# EAGLE design minicar_r3 (EAGLE 7.7.0)
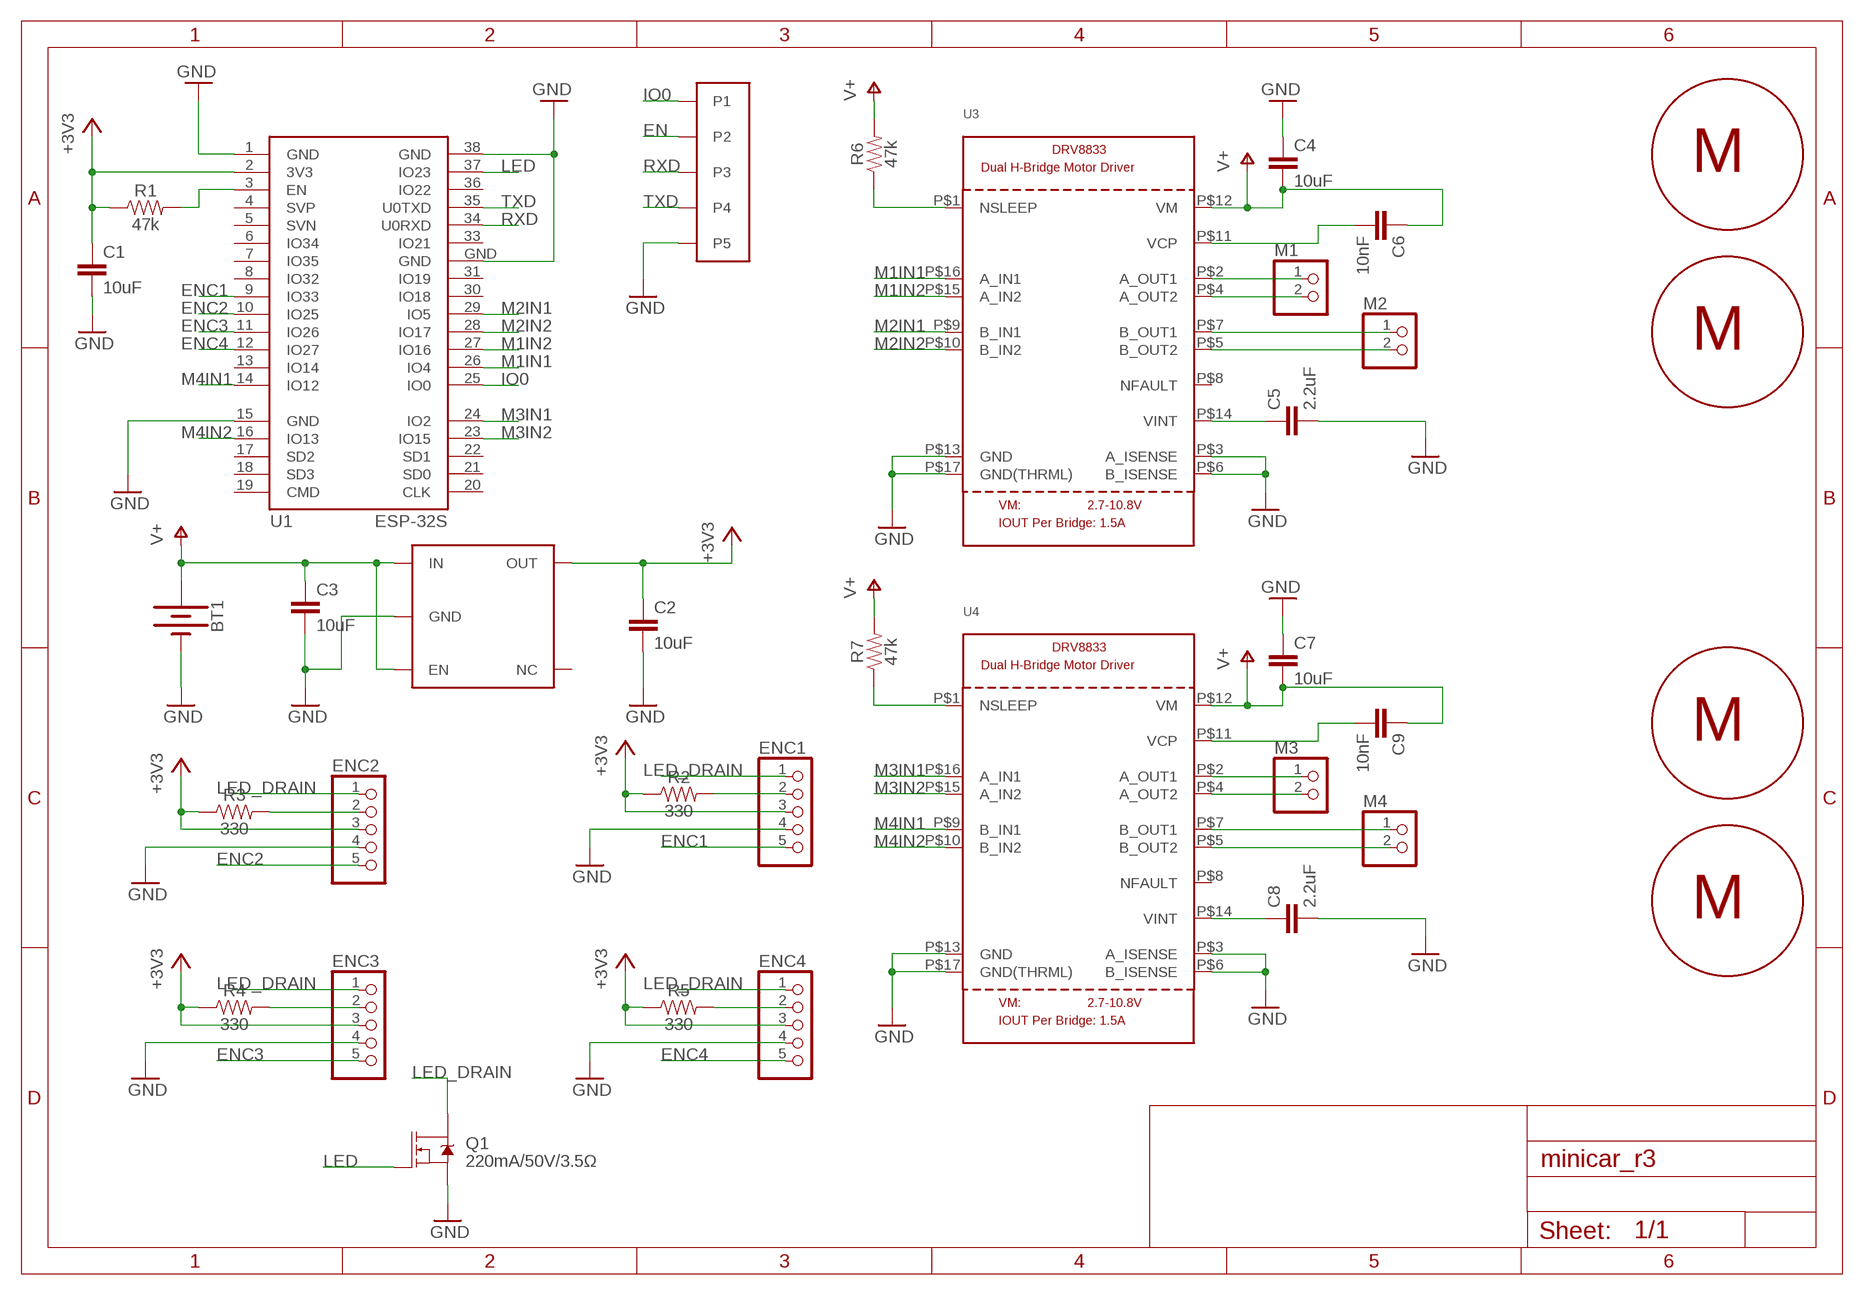
[diagram p0: schematic, sheet 1]

## Parts
BT1  BATTERY-AA  [BATTERY-AA]
C1  10uF  10UF-0805-10V-10%  [0805]
C2  10uF  10UF-0805-10V-10%  [0805]
C3  10uF  10UF-0805-10V-10%  [0805]
C4  10uF  10UF-0805-10V-10%  [0805]
C5  2.2uF  2.2UF-0603-10V-20%  [0603]
C6  10nF  10NF-0603-50V-10%  [0603]
C7  10uF  10UF-0805-10V-10%  [0805]
C8  2.2uF  2.2UF-0603-10V-20%  [0603]
C9  10nF  10NF-0603-50V-10%  [0603]
ENC1  PINHD-1X5  [1X05]
ENC2  PINHD-1X5  [1X05]
ENC3  PINHD-1X5  [1X05]
ENC4  PINHD-1X5  [1X05]
M1  PINHD-1X2  [1X02]
M2  PINHD-1X2  [1X02]
M3  PINHD-1X2  [1X02]
M4  PINHD-1X2  [1X02]
Q1  220mA/50V/3.5Ω  MOSFET-NCH-BSS138  [SOT23-3]
R1  47k  47KOHM-0603-1/10W-1%  [0603]
R2  330  330OHM-0603-1/10W-1%  [0603]
R3  330  330OHM-0603-1/10W-1%  [0603]
R4  330  330OHM-0603-1/10W-1%  [0603]
R5  330  330OHM-0603-1/10W-1%  [0603]
R6  47k  47KOHM-0603-1/10W-1%  [0603]
R7  47k  47KOHM-0603-1/10W-1%  [0603]
U1  ESP-32S  [ESP-32S]
U2  53047  [PICOBLADE_53047]
U3  DRV8833  [HTSSOP16]
U4  DRV8833  [HTSSOP16]
U5  TLV755  [SOT23-DBV]
U$2  MOTOR_10X27MM  [MOTOR]
U$3  MOTOR_10X27MM  [MOTOR]
U$4  MOTOR_10X27MM  [MOTOR]
U$5  MOTOR_10X27MM  [MOTOR]

## Nets
+3V3: C1.1 C2.1 ENC1.3 ENC2.3 ENC3.3 ENC4.3 R1.1 R2.1 R3.1 R4.1 R5.1 U1.2(3V3) U5.5(OUT)
EN: R1.2 U1.3(EN) U2.P$2(P2)
ENC1: ENC1.5 U1.9(IO33)
ENC2: ENC2.5 U1.10(IO25)
ENC3: ENC3.5 U1.11(IO26)
ENC4: ENC4.5 U1.12(IO27)
GND: BT1.GND@1(-) C1.2 C2.2 C3.2 C4.1 C5.2 C7.1 C8.2 ENC1.4 ENC2.4 ENC3.4 ENC4.4 Q1.2(S) U1.1(GND) U1.15(GND) U1.38(GND) U1.GND U2.P$5(P5) U3.P$3(A_ISENSE) U3.P$6(B_ISENSE) U3.P$13(GND) U3.P$17(GND(THRML)) U4.P$3(A_ISENSE) U4.P$6(B_ISENSE) U4.P$13(GND) U4.P$17(GND(THRML)) U5.2(GND)
IO0: U1.25(IO0) U2.P$1(P1)
LED: Q1.1(G) U1.37(IO23)
LED_DRAIN: ENC1.1 ENC2.1 ENC3.1 ENC4.1 Q1.3(D)
M1IN1: U1.26(IO4) U3.P$16(A_IN1)
M1IN2: U1.27(IO16) U3.P$15(A_IN2)
M2IN1: U1.29(IO5) U3.P$9(B_IN1)
M2IN2: U1.28(IO17) U3.P$10(B_IN2)
M3IN1: U1.24(IO2) U4.P$16(A_IN1)
M3IN2: U1.23(IO15) U4.P$15(A_IN2)
M4IN1: U1.14(IO12) U4.P$9(B_IN1)
M4IN2: U1.16(IO13) U4.P$10(B_IN2)
N$1: M1.1 U3.P$2(A_OUT1)
N$2: M1.2 U3.P$4(A_OUT2)
N$3: M2.1 U3.P$7(B_OUT1)
N$4: M2.2 U3.P$5(B_OUT2)
N$5: C5.1 U3.P$14(VINT)
N$6: C6.2 U3.P$11(VCP)
N$7: M3.1 U4.P$2(A_OUT1)
N$8: M3.2 U4.P$4(A_OUT2)
N$9: M4.1 U4.P$7(B_OUT1)
N$10: M4.2 U4.P$5(B_OUT2)
N$11: C8.1 U4.P$14(VINT)
N$12: C9.2 U4.P$11(VCP)
N$13: ENC1.2 R2.2
N$14: ENC4.2 R5.2
N$15: ENC3.2 R4.2
N$16: ENC2.2 R3.2
N$17: R6.1 U3.P$1(NSLEEP)
N$18: R7.1 U4.P$1(NSLEEP)
RXD: U1.34(U0RXD) U2.P$3(P3)
TXD: U1.35(U0TXD) U2.P$4(P4)
V+: BT1.PWR@1(+) C3.1 C4.2 C6.1 C7.2 C9.1 R6.2 R7.2 U3.P$12(VM) U4.P$12(VM) U5.1(IN) U5.3(EN)
Unconnected: U1.4(SVP) U1.5(SVN) U1.6(IO34) U1.7(IO35) U1.8(IO32) U1.13(IO14) U1.17(SD2) U1.18(SD3) U1.19(CMD) U1.20(CLK) U1.21(SD0) U1.22(SD1) U1.30(IO18) U1.31(IO19) U1.33(IO21) U1.36(IO22) U3.P$8(NFAULT) U4.P$8(NFAULT) U5.4(NC)

## Library data of the parts
BT1 = SparkFun-Batteries:BATTERY: Battery - Single Cell A variety of battery chemistries, sizes, and footprints. Device List: 20MM_PTH - Coin Cell Battery Holder - 20mm (PTH) <https://www.sparkfun.com/products/783> 12MM_SMD - Coin Cell Battery Holder - 12mm (SMD) <https://www.sparkfun.com/products/10592> 12MM_PTH - Coin Cell Battery Holder - 12mm (PTH) <https://www.sparkfun.com/products/7948> 20MM_SMD - 20mm Coin Cell Battery Holder (SMD) (2 legs) Used on the Big Time Watch Kit <https://www.sparkfun.com/products/11734> 20MM_SMD_4LEGS - Coin Cell Battery Holder - 20mm (SMD) <https://www.sparkfun.com/products/11892> 20MM_SMD_4LEGS_OVERPASTE - Coin Cell Battery Holder - 20mm (SMD) <https://www.sparkfun.com/products/11892> (Over-paste on the legs) 24.5MM_PTH - Coin Cell Battery Holder - 24.5mm (PTH) <https://www.sparkfun.com/products/8863> 9V - 9V Battery Holder - PC Mount Used on the SparkFun SparkPunk Sound Kit <https://www.sparkfun.com/products/11177> and SparkFun SparkPunk Sequencer Kit <https://www.sparkfun.com/products/12707> 18650 - Battery Holder - 18650 (PTH) <https://www.sparkfun.com/products/13113> AA - Battery Holder - 1xAA (PTH) <https://www.sparkfun.com/products/7949> AAA - Battery Holder - 1xAAA (PTH) <https://www.sparkfun.com/products/12718> AA_KIT - Battery Holder - 1xAA (PTH) <https://www.sparkfun.com/products/7949> Special kit package - pads only have exposed copper on one side of the board. AAA_KIT - Battery Holder - 1xAAA (PTH) <https://www.sparkfun.com/products/12718> Special kit package - pads only have exposed copper on one side of the board.; PROD_ID: BATT-08316; SF_SKU: PRT-07949
C1-C4 C7 = SparkFun-Capacitors:10UF: 10.0µF ceramic capacitors A capacitor is a passive two-terminal electrical component used to store electrical energy temporarily in an electric field.; PROD_ID: CAP-11330
C5 C8 = SparkFun-Capacitors:2.2UF: 2.2µF ceramic capacitors A capacitor is a passive two-terminal electrical component used to store electrical energy temporarily in an electric field.; PROD_ID: CAP-07888
C6 C9 = SparkFun-Capacitors:10NF: 0.01uF/10nF/10,000pF ceramic capacitors A capacitor is a passive two-terminal electrical component used to store electrical energy temporarily in an electric field. CAP-09321; PROD_ID: CAP-00867
ENC1-ENC4 = pinhead:PINHD-1X5: PIN HEADER
M1-M4 = pinhead:PINHD-1X2: PIN HEADER
Q1 = SparkFun-DiscreteSemi:MOSFET-NCH: N-channel MOSFETs Voltage controlled devices that allow control of high current outputs. SparkFun Products: SparkFun OpenScale <https://www.sparkfun.com/products/13261> SparkFun Digital Sandbox <https://www.sparkfun.com/products/12651> SparkFun Monster Moto Shield <https://www.sparkfun.com/products/10182> SparkFun MOSFET Power Controller <https://www.sparkfun.com/products/11214>; PROD_ID: TRANS-00830
R1 R6 R7 = SparkFun-Resistors:47KOHM: 47kΩ resistor A resistor is a passive two-terminal electrical component that implements electrical resistance as a circuit element. Resistors act to reduce current flow, and, at the same time, act to lower voltage levels within circuits. - Wikipedia; PROD_ID: RES-07871
R2-R5 = SparkFun-Resistors:330OHM: 330Ω resistor A resistor is a passive two-terminal electrical component that implements electrical resistance as a circuit element. Resistors act to reduce current flow, and, at the same time, act to lower voltage levels within circuits. - Wikipedia; PROD_ID: RES-00818
U1 = esp32:ESP-32S: Ai-Thinker ESP-32S
U2 = molex:53047
U3 U4 = microbuilder:DRV8833: DRV8833 Dual H-Bridge Motor Driver -- HTSSOP Package
U5 = texas:TLV755
U$2-U$5 = motor:MOTOR_10X27MM

## Board
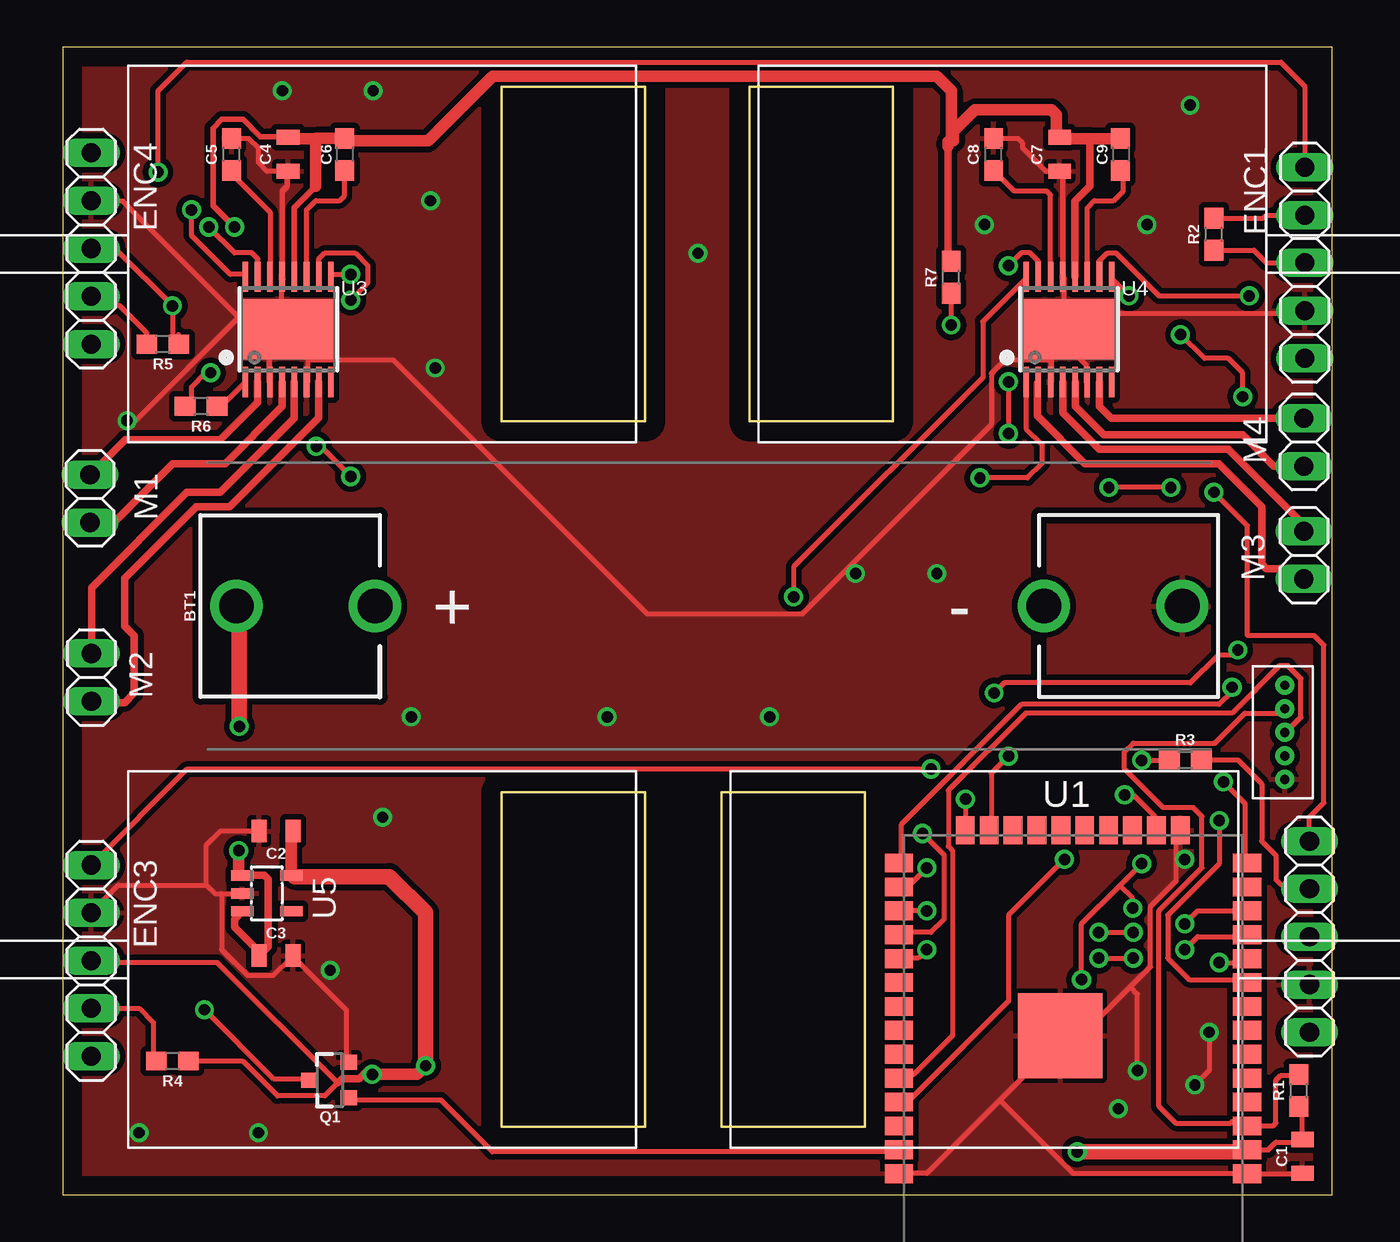
[diagram p1: board, top side]
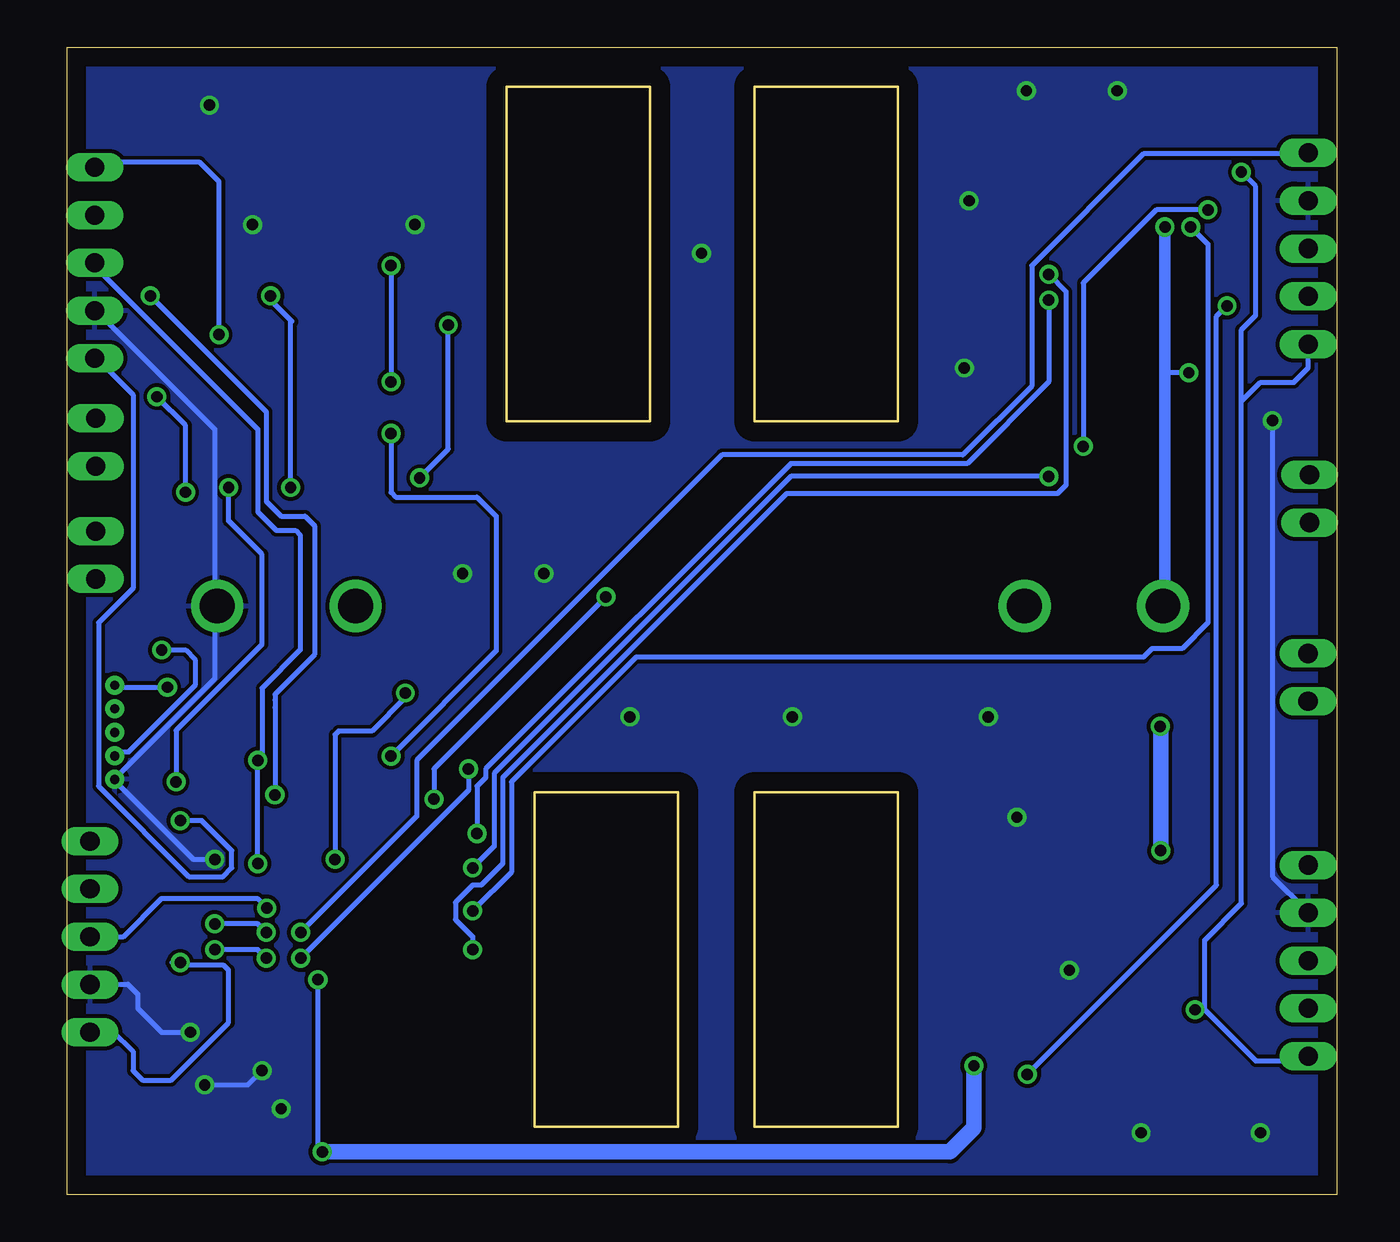
[diagram p2: board, bottom side, seen from below]

Size 67.5 x 61 mm. Coordinates in mm from the lower left corner, seen from the top.
Outline: 0,0 67.5,0 67.5,61 0,61 0,0
Copper layers (1*16): Top 0.035mm / dielectric 1.5mm / Bottom 0.035mm
Design rules "default": minimum track width 10mil, minimum drill 24mil, track to track 8mil, track to pad 8mil, pad to pad 8mil, via to via 8mil, smd to smd 8mil, copper to edge 40mil, drill to drill 8mil, minimum pad ring 10mil, minimum via ring 8mil, stop-mask expansion 4mil, vias tented up to drill 0mil, thermal gap 10mil

### Footprints (pad centres in the part's own frame; a part is rotated, then mirrored left to right if it is on the bottom)
BATTERY-AA = drill 1.854: GND@1 25.146,0; GND@2 17.78,0; PWR@1 -25.146,0; PWR@2 -17.78,0
0805 = smd 0.8 x 1.2: 1 -0.9,0; 2 0.9,0
0603 = smd 1.1 x 1: 1 -0.85,0; 2 0.85,0
1X05 = drill 1.016 long: 1 -5.08,0; 2 -2.54,0; 3 0,0; 4 2.54,0; 5 5.08,0
1X02 = drill 1.016 long: 1 -1.27,0; 2 1.27,0
SOT23-3 = smd 0.8 x 0.9: 1 -0.95,-1; 2 0.95,-1; 3 0,1.1
ESP-32S = smd 1.5 x 1: 1 -9.25,7; 2 -9.25,5.73; 3 -9.25,4.46; 4 -9.25,3.19; 5 -9.25,1.92; 6 -9.25,0.65; 7 -9.25,-0.62; 8 -9.25,-1.89; 9 -9.25,-3.16; 10 -9.25,-4.43; 11 -9.25,-5.7; 12 -9.25,-6.97; 13 -9.25,-8.24; 14 -9.25,-9.51; 25 9.25,-9.51; 26 9.25,-8.24; 27 9.25,-6.97; 28 9.25,-5.7; 29 9.25,-4.43; 30 9.25,-3.16; 31 9.25,-1.89; 32 9.25,-0.62; 33 9.25,0.65; 34 9.25,1.92; 35 9.25,3.19; 36 9.25,4.46; 37 9.25,5.73; 38 9.25,7 | smd 1 x 1.5: 15 -5.7,-11.25; 16 -4.43,-11.25; 17 -3.16,-11.25; 18 -1.89,-11.25; 19 -0.62,-11.25; 20 0.65,-11.25; 21 1.92,-11.25; 22 3.19,-11.25; 23 4.46,-11.25; 24 5.73,-11.25 | smd 4.5 x 4.5: GND 0.68,-0.33
PICOBLADE_53047 = drill 0.5 pad 0.813: P$1 -2.5,0; P$2 -1.25,0; P$3 0,0; P$4 1.25,0; P$5 2.5,0
HTSSOP16 = smd 0.3 x 1.6: P$1 -2.275,-2.8; P$2 -1.625,-2.8; P$3 -0.975,-2.8; P$4 -0.325,-2.8; P$5 0.325,-2.8; P$6 0.975,-2.8; P$7 1.625,-2.8; P$8 2.275,-2.8; P$9 2.275,2.8; P$10 1.625,2.8; P$11 0.975,2.8; P$12 0.325,2.8; P$13 -0.325,2.8; P$14 -0.975,2.8; P$15 -1.625,2.8; P$16 -2.275,2.8 | smd 4.8 x 3.2: P$17 0,0
SOT23-DBV = smd 0.55 x 1.2: 1 -0.95,-1.3; 2 0,-1.3; 3 0.95,-1.3; 4 0.95,1.3; 5 -0.95,1.3

### Placement (x,y rotation side)
BT1  34.39,31.29 0 top
C1  65.92,2.04 270 top
C2  11.36,19.33 180 top
C3  11.36,12.71 0 top
C4  11.99,55.29 90 top
C5  8.99,55.29 90 top
C6  14.99,55.29 270 top
C7  53,55.29 90 top
C8  49.5,55.29 90 top
C9  56.25,55.29 270 top
ENC1  66.04,49.53 270 top
ENC2  66.29,13.72 270 top
ENC3  1.52,12.45 90 top
ENC4  1.52,50.29 90 top
M1  1.46,37 270 top
M2  1.54,27.5 90 top
M3  66,34 90 top
M4  66,40 270 top
Q1  14.22,6.1 90 top
R1  65.73,5.54 90 top
R2  61.21,51.05 90 top
R3  59.69,23.11 0 top
R4  5.84,7.11 180 top
R5  5.33,45.21 180 top
R6  7.37,41.91 180 top
R7  47.24,48.77 90 top
U1  53.72,8.12 180 top
U2  64.98,24.58 270 top
U3  12,46 0 top
U4  53.5,46 0 top
U5  10.86,16.02 270 top
U$2  17,50 0 top
U$3  17,12.5 0 top
U$4  49,12.5 180 top
U$5  50.5,50 180 top

### Tracks (layer width: path | path; a pad name or v marks a point on that pad's centre or on a via)
+3V3  (via drill 0.6, 0.61)
  Top 0.254: R1.1 65.92,4.5 C1.1 65.77,2.79 64.52,2.79 64.11,2.39 U1.2 62.87,2.29 | v57.38,23.09 58.75,23.09 R3.1 | 65.84,49.61 ENC1.3 64.01,49.53 63.33,50.2 R2.1 | 6.17,45.72 6.17,45.26 R5.1 5.84,45.55 v5.84,47.24 2.79,50.29 ENC4.3 | R4.1 6.86,7.09 9.6,7.09 11.43,5.26 13.95,5.26 14.63,5.94 8.23,12.34 1.6,12.34 ENC3.3 | 16.23,6.63 v16.46,6.4 | 56.21,16.43 54.18,14.4 v54.18,11.43 | 56.21,16.43 v57.38,17.6 | 56.21,16.43 56.9,15.75 v56.9,15.24
  Top 0.406: 12.16,19.23 C2.1 | 14.63,5.94 14.86,6.17 15.77,6.17 16.23,6.63 | 12.34,16.92 U5.5
  Top 0.61: U5.5 12.16,19.23 | 19.3,9.96 19.3,9.91 | v16.46,6.4 18.85,6.4 v19.3,6.86
  Top 0.813: v53.95,2.29 62.87,2.29 | 19.3,9.91 v19.3,6.86 | 12.34,16.92 17.37,16.92 19.3,14.99 19.3,9.96
  Bottom 0.254: ENC1.3 66.06,49.38 57.38,40.69 57.38,36.3 56.39,35.31 55.37,35.31 55.12,35.05 55.12,28.96 57.15,26.92 57.15,23.32 v57.38,23.09 v57.38,17.6 | v16.46,6.4 6.4,16.46 6.4,46.69 v5.84,47.24 | 1.6,50.29 ENC4.3 | v54.18,11.43 54.18,2.52 v53.95,2.29 | ENC2.3 64.52,13.72 62.48,15.75 57.4,15.75 v56.9,15.24
  Bottom 0.813: v53.95,2.29 20.57,2.29 19.3,3.56 v19.3,6.86
EN
  Top 0.254: R1.2 65.69,6.35 64.77,6.35 64.52,6.1 64.52,3.81 64.37,3.66 U1.3 62.87,3.89 62.18,3.89 62.1,3.81 59.18,3.81 58.29,4.7 58.29,15.09 60.58,17.37 60.58,20.12 60.12,20.57 58.52,20.57 56.46,22.63 56.46,23.55 56.92,24 61.27,24 62.87,25.6 64.92,25.6 U2.P$2
ENC1  (via drill 0.61)
  Top 0.254: v61.49,19.89 61.49,17.6 58.75,14.86 58.75,12.57 59.89,11.43 62.87,11.43 U1.9
  Bottom 0.254: v61.49,19.89 60.35,19.89 58.75,18.29 58.75,17.37 59.21,16.92 61.04,16.92 65.84,21.72 65.84,30.4 64.01,32.23 64.01,42.52 65.84,44.35 ENC1.5
ENC2  (via drill 0.61)
  Top 0.254: v61.49,12.34 62.87,12.34 U1.10
  Bottom 0.254: 61.95,12.34 v61.49,12.34 61.34,12.19 59.18,12.19 58.93,11.94 58.93,9.14 61.98,6.1 63.5,6.1 64.01,6.6 64.01,7.62 65.08,8.69 65.61,8.69 ENC2.5
ENC3  (via drill 0.61)
  Top 0.254: v59.66,13.03 60.35,13.72 62.87,13.72 U1.11 | v55.09,12.57 v56.92,12.57 | v46.18,22.63 6.63,22.63 ENC3.5
  Bottom 0.254: v59.66,13.03 57.38,13.03 v56.92,12.57 | v55.09,12.57 46.18,21.49 v46.18,22.63
ENC4  (via drill 0.61)
  Top 0.254: v59.66,14.4 60.35,15.09 62.87,15.09 U1.12 | v55.09,13.95 v56.92,13.95
  Bottom 0.254: v59.66,14.4 57.38,14.4 v56.92,13.95 | v55.09,13.95 48.92,20.12 48.92,23.09 32.69,39.32 19.89,39.32 16.23,42.98 16.23,49.38 10.29,55.32 1.6,55.32 ENC4.5
GND  (via drill 0.6, 0.61)
  Top 0.254: 11.94,54.34 C4.1 10.88,54.39 10.41,54.86 10.41,55.63 9.91,56.13 9,56.13 C5.2 | 53.17,54.22 C7.1 52.29,54.39 51.05,55.63 51.05,55.88 50.8,56.13 C8.2 | C2.2 8.41,19.33 7.62,18.54 7.62,16.51 | 7.62,16.51 8.13,16 8.46,16 | 8.46,16 9.54,16 U5.2 | C1.2 65.9,1.12 U1.1 62.87,1.14 53.72,1.14 49.84,5.03 | Q1.2 15.09,7.09 15.09,9.83 12.34,12.57 C3.2 12.12,12.57 11.2,11.66 9.83,11.66 8.46,13.03 8.46,16 | 7.62,16.51 7.54,16.46 2.97,16.46 1.6,15.09 ENC3.4 | 10.97,45.03 11.89,45.95 U3.P$17 | 10.97,43.2 U3.P$3 | 13.03,44.35 13.03,45.03 12.12,45.95 U3.P$17 | 13.03,44.35 13.03,43.2 U3.P$6 | 10.97,45.03 9.37,46.63 | 9.37,46.63 3.2,52.81 1.6,52.81 ENC4.4 | 10.97,45.03 U3.P$17 | U3.P$13 11.66,48.69 11.66,46.41 11.89,46.18 U3.P$17 | v3.43,41.15 3.89,41.15 9.37,46.63 | 49.84,5.03 53.03,8.23 U1.GND 53.26,8.46 54.18,8.46 56.77,11.05 | 49.84,5.03 45.95,1.14 44.58,1.14 U1.38 | 59.21,17.83 59.21,16.69 57.84,15.32 57.84,12.12 56.77,11.05 | 59.21,17.83 59.21,19.2 U1.15 | 53.03,45.49 53.49,45.95 U4.P$17 | 53.03,45.49 52.58,45.03 52.58,44.35 50.06,44.35 49.38,43.66 49.38,40.92 39.32,30.86 31.09,30.86 17.6,44.35 13.03,44.35 | 52.58,43.2 U4.P$3 | 53.03,45.49 54.41,44.12 54.41,43.2 U4.P$6 | 53.03,45.49 U4.P$17 | 54.18,46.63 53.72,46.18 U4.P$17 | 54.18,46.63 54.41,46.86 65.84,46.86 ENC1.4 | 54.18,46.63 53.26,47.55 53.26,48.69 U4.P$13 | 54.18,46.63 U4.P$17 | v59.66,17.83 59.21,17.83 | v60.96,8.64 60.96,6.6 v60.2,5.84 | v57.15,6.6 57.15,10.67 56.77,11.05
  Top 0.305: U3.P$13 11.68,53.33 11.94,53.59 11.94,54.34 | U4.P$13 53.17,54.22 | 10.97,45.03 10.97,43.2 | 52.58,44.35 52.58,43.2
  Bottom 0.254: v3.43,41.15 3.43,16.92 1.6,15.09 ENC3.4 | ENC1.4 65.84,46.86 59.66,40.69 59.66,31.32 BT1.GND@1 59.66,31.09 59.66,27.43 64.92,22.17 U2.P$5 64.92,21.95 60.81,17.83 v59.66,17.83 | v60.96,8.64 62.48,8.64 63.75,9.91 63.75,10.67 64.29,11.2 66.27,11.2 ENC2.4 | v60.2,5.84 57.91,5.84 v57.15,6.6
  other vias: 11.68,58.67 16.51,58.67 19.81,43.94 19.56,52.83 33.78,50.04 59.94,57.91 57.66,51.56 49.02,51.56 18.54,25.4 28.96,25.4 46.48,33.02 14.22,11.94 17.02,20.07 4.06,3.3 10.41,3.3 42.16,33.02 37.59,25.4 56.13,4.57
  pour Top (isolate 0.305): 0,60.2 67.82,60.2 67.82,0 0,0
  pour Bottom: -1.02,-0.51 69.6,-0.51 69.6,61.72 -1.02,61.72
IO0  (via drill 0.61)
  Top 0.254: v62.18,26.98 62.18,26.75 61.49,26.06 50.98,26.06 44.58,19.66 44.58,17.83 U1.25
  Bottom 0.254: v62.18,26.98 64.92,26.98 U2.P$1
LED
  Top 0.254: Q1.1 15.32,5.03 20.12,5.03 22.86,2.29 44.35,2.29 U1.37
LED_DRAIN  (via drill 0.6)
  Top 0.254: v7.54,9.83 11.2,6.17 13.03,6.17 Q1.3 | ENC2.1 66.29,20.07 67.06,20.83 67.06,29.21 66.55,29.72 62.99,29.72 62.99,35.56 v61.21,37.34 | v62.74,42.42 62.74,43.69 61.98,44.45 60.71,44.45 v59.44,45.72 | v5.08,54.36 5.08,58.67 6.6,60.2 64.77,60.2 66.04,58.93 ENC1.1
  Bottom 0.254: v7.54,9.83 7.04,9.83 | 7.04,9.83 4.32,7.11 1.78,7.11 ENC3.1 | 7.04,9.83 7.04,13.54 5.08,15.49 5.08,42.16 | 5.08,42.16 4.06,43.18 2.29,43.18 1.52,43.94 ENC4.1 | v61.21,37.34 61.21,40.89 v62.74,42.42 | v59.44,45.72 59.44,53.85 60.45,54.86 65.79,54.86 ENC1.1 | 5.08,42.16 5.08,45.97 4.32,46.74 4.32,53.59 v5.08,54.36
M1IN1  (via drill 0.61)
  Top 0.254: v45.95,17.37 45.03,16.46 44.58,16.46 U1.26 | v15.32,38.18 13.72,39.78 v13.49,39.78 | v6.86,52.35 6.86,50.98 8.91,48.92 9.6,48.92 U3.P$16
  Bottom 0.254: v45.95,17.37 44.81,18.52 44.81,22.4 29.03,38.18 v15.32,38.18 | v13.49,39.78 13.49,48.46 9.6,52.35 v6.86,52.35
M1IN2  (via drill 0.61)
  Top 0.254: v45.95,15.09 44.58,15.09 U1.27 | v7.77,51.44 9.14,50.06 10.06,50.06 10.38,49.75 U3.P$15
  Bottom 0.254: v45.95,15.09 43.89,17.14 43.89,21.95 37.26,28.57 10.29,28.57 9.83,29.03 8.23,29.03 6.86,30.4 6.86,50.52 v7.77,51.44
M2IN1  (via drill 0.61)
  Top 0.254: v45.95,13.03 45.49,12.57 44.58,12.57 U1.29 | v15.32,48.92 14.4,48.92 U3.P$9
  Bottom 0.254: v45.95,13.03 45.95,13.72 46.86,14.63 46.86,15.54 45.95,16.46 45.49,16.46 44.35,17.6 44.35,22.17 29.26,37.26 14.86,37.26 14.4,37.72 14.4,48.01 v15.32,48.92
M2IN2  (via drill 0.61)
  Top 0.254: v45.72,19.2 46.86,18.06 46.86,14.63 46.18,13.95 44.58,13.95 U1.28 | v15.32,47.55 16.23,48.46 16.23,49.38 15.54,50.06 13.95,50.06 13.62,49.74 U3.P$10
  Bottom 0.254: v45.72,19.2 45.72,21.72 45.26,22.17 45.26,22.63 29.03,38.86 19.66,38.86 15.32,43.2 v15.32,47.55
M3IN1  (via drill 0.61)
  Top 0.254: v48.01,21.03 48.01,19.43 U1.24 | v38.86,31.77 38.86,33.38 48.92,43.43 48.92,46.41 51.21,48.69 U4.P$16
  Bottom 0.254: v48.01,21.03 48.01,22.63 v38.86,31.77
M3IN2  (via drill 0.61)
  Top 0.254: v50.29,23.32 49.38,22.4 49.38,19.43 U1.23 | v50.29,43.2 v50.29,40.46 | v50.29,49.38 50.98,50.06 51.44,50.06 51.89,49.61 51.89,48.92 U4.P$15
  Bottom 0.254: v50.29,49.38 v50.29,43.2 | v50.29,40.46 50.29,37.34 50.04,37.08 45.72,37.08 44.7,36.07 44.7,28.91 v50.29,23.32
M4IN1  (via drill 0.6, 0.61)
  Top 0.254: v61.72,21.95 62.87,20.8 62.87,17.83 U1.14 | v56.69,47.78 55.78,48.69 U4.P$9 | 55.55,37.59 v55.63,37.59 v58.93,37.59
  Bottom 0.254: v61.72,21.95 61.72,24.69 57.15,29.26 57.15,34.04 58.93,35.81 v58.93,37.59 | 55.63,46.48 56.69,47.55 v56.69,47.78 | 55.63,46.48 55.55,46.41 | v55.63,37.59 55.63,46.48
M4IN2  (via drill 0.61)
  Top 0.254: v56.46,21.26 56.92,21.26 58.06,20.12 58.06,19.43 U1.16 | v63.09,47.78 58.29,47.78 56.01,50.06 55.55,50.06 55.09,49.61 55.09,48.92 U4.P$10
  Bottom 0.254: v56.46,21.26 56.46,25.91 56.46,26.29 56.46,26.59 54.36,28.7 54.36,35.56 54.86,36.07 56.13,36.07 56.92,36.85 56.92,41.6 v63.09,47.78
N$1
  Top 0.406: U3.P$2 10.38,42.12 8.38,40.13 3.32,40.13 M1.1
N$2
  Top 0.254: U3.P$4
  Top 0.406: M1.2 2.71,35.73 5.84,38.86 8.64,38.86 11.68,41.91 U3.P$4
N$3
  Top 0.254: 1.61,26.16 M2.1
  Top 0.406: U3.P$7 13.62,41.31 8.89,36.58 7.11,36.58 3.3,32.77 3.3,30.23 3.81,29.72 3.81,26.67 3.3,26.16 1.61,26.16
N$4
  Top 0.406: M2.2 1.54,32.27 6.6,37.34 8.38,37.34 12.32,41.28 U3.P$5
N$5
  Top 0.254: C5.1 8.99,54.25 11.03,52.22 U3.P$14
N$6
  Top 0.254: U3.P$11 12.97,52.34 13.46,52.83 14.73,52.83 14.99,53.09 C6.2
N$7
  Top 0.254: 51.82,43.14 U4.P$2
  Top 0.406: M3.1 65.46,33.27 64.01,33.27 63.75,33.53 63.75,36.58 61.47,38.86 54.36,38.86 51.82,41.4 51.82,43.14
N$8
  Top 0.406: M3.2 66,35.6 61.98,39.62 55.12,39.62 53.17,41.57 U4.P$4
N$9
  Top 0.254: U4.P$7
  Top 0.406: M4.1 55.76,41.27 55.12,41.91 U4.P$7
N$10
  Top 0.254: 53.85,43.18 U4.P$5
  Top 0.406: M4.2 64.39,38.73 62.74,40.39 55.37,40.39 53.85,41.91 53.85,43.18
N$11
  Top 0.254: U4.P$14 52.52,53.14 52.32,53.34 50.6,53.34 C8.1
N$12
  Top 0.254: U4.P$11 54.48,52.44 54.86,52.83 55.88,52.83 56.39,53.34 56.39,54.3 C9.2
N$13
  Top 0.254: R2.2 63.84,51.9 64.01,52.07 ENC1.2
N$14
  Top 0.254: R5.2 4.48,45.81 3.05,47.24 2.03,47.24 ENC4.2
N$15
  Top 0.254: 4.83,7.11 R4.2 4.83,7.28 4.83,9.14 4.06,9.91 ENC3.2
N$16
  Top 0.254: R3.2 62.48,23.11 63.75,21.84 63.75,18.8 64.52,18.03 64.52,16.76 65.02,16.26 ENC2.2
N$17
  Top 0.254: U3.P$1 8.44,41.91 R6.1
N$18  (via drill 0.6)
  Top 0.254: U4.P$1 51.23,40.72 52.07,39.88 52.07,38.86 51.31,38.1 v48.77,38.1 | v47.24,46.23 R7.1
  Bottom 0.254: v48.77,38.1 47.24,39.62 v47.24,46.23
RXD
  Top 0.254: U1.34 44.58,6.4 45.26,6.4 47.32,8.46 47.32,18.29 47.09,18.52 47.09,21.49 51.21,25.6 62.18,25.6 64.69,28.12 65.15,28.12 65.84,27.43 65.84,25.38 65.15,24.69 U2.P$3
TXD  (via drill 0.6, 0.61)
  Top 0.254: v53.26,17.83 50.29,14.86 50.29,10.29 45.03,5.03 44.58,5.03 U1.35 | v62.48,28.96 62.23,28.7 61.47,28.7 59.97,27.2 50.06,27.2 v49.53,26.67
  Bottom 0.254: v53.26,17.83 53.26,24.46 53.09,24.64 51.31,24.64 49.53,26.42 v49.53,26.67 | U2.P$4 64.92,23.55 64.24,23.55 60.71,27.08 60.71,28.45 61.21,28.96 v62.48,28.96
V+  (via drill 0.6, 0.61)
  Top 0.254: 12.05,56.13 C4.2 11.89,56.24 | 13.47,56.14 13.46,56.13 | 56.24,56.13 C9.1 | 53.06,56.13 C7.2 52.81,56.24 | C3.1 10.46,12.91 | 9.37,17.14 U5.1 | 15.09,56.01 C6.1 | R7.2 47.08,49.78 | R6.2 6.86,42.25 6.86,42.93 7.62,43.69 v7.87,43.69
  Top 0.305: U3.P$12 12.32,52.46 13.46,53.59 | 11.89,56.24 10.52,56.24 9.6,57.15 8.46,57.15 8,56.69 8,52.58 v9.14,51.44
  Top 0.406: U4.P$12 53.83,52.81 54.61,53.59 54.61,56.13 | 10.46,12.91 9.14,14.22 9.14,14.65 U5.3 | U5.1 10.72,16.97 10.92,16.76 10.92,13.17 C3.1 | 9.37,31.09 BT1.PWR@1 | 47.08,49.78 47.08,55.71
  Top 0.61: 13.46,53.59 13.46,56.13 12.05,56.13 | C6.1 13.47,56.14 | 56.24,56.13 54.61,56.13 53.06,56.13 | v9.37,18.29 9.37,17.14 | 15.09,56.01 19.43,56.01 22.86,59.44 46.48,59.44 47.24,58.67 47.24,56.13 | 47.24,56.13 47.37,56.01 47.37,56.52 48.51,57.66 52.58,57.66 52.83,57.4 52.83,56.36 C7.2 | 47.08,55.71 47.08,55.97 47.24,56.13
  Top 0.813: v9.4,24.89 9.4,31.14 BT1.PWR@1
  Bottom 0.254: 9.14,31.32 BT1.PWR@1 | v7.87,43.69 9.14,43.69
  Bottom 0.61: 9.14,31.32 9.14,43.69 v9.14,51.44
  Bottom 0.813: v9.37,18.29 9.37,24.87 v9.4,24.89